# Altium schematic sheet TSAL_REV2_2.SchDoc
size A
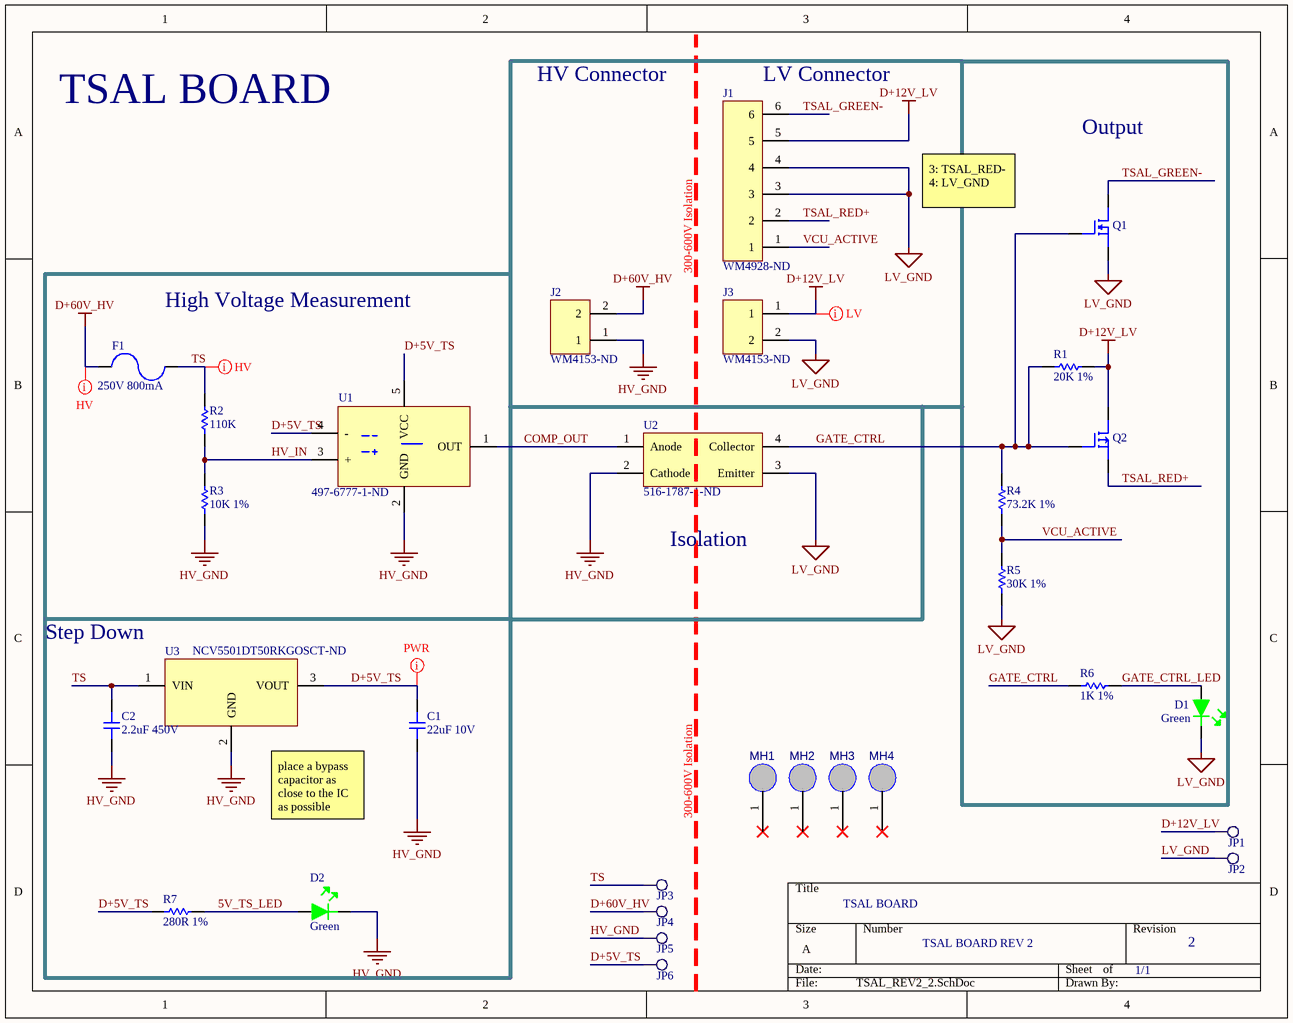
[diagram p0: TSAL_REV2_2.SchDoc]

## Parts
C1  22uF 10V  [CAP-0805]
C2  2.2uF 450V  [CAP-2220]
D1  Green  [LED-0603]
D2  Green  [LED-0603]
F1  250V 800mA  [Fuse-10x3]
J1  WM4928-ND  [6PIN]
J2  WM4153-ND  [2PIN]
J3  WM4153-ND  [2PIN]
JP1  Testpoint2  [TP2]  (value not drawn)
JP2  Testpoint2  [TP2]  (value not drawn)
JP3  Testpoint2  [TP2]  (value not drawn)
JP4  Testpoint2  [TP2]  (value not drawn)
JP5  Testpoint2  [TP2]  (value not drawn)
JP6  Testpoint2  [TP2]  (value not drawn)
MH1  MountingHole  [MH4.2MM]  (value not drawn)
MH2  MountingHole  [MH4.2MM]  (value not drawn)
MH3  MountingHole  [MH4.2MM]  (value not drawn)
MH4  MountingHole  [MH4.2MM]  (value not drawn)
Q1  IPD50N06S4L12ATMA2CT-ND  [DPAK-TO252]  (value not drawn)
Q2  NTD2955T4GOSCT-ND  [DPAK-TO252]  (value not drawn)
R1  20K 1%  [RES-0603]
R2  110K  [RES-0805]
R3  10K 1%  [RES-0805]
R4  73.2K 1%  [RES-0603]
R5  30K 1%  [RES-0603]
R6  1K 1%  [RES-0603]
R7  280R 1%  [RES-0603]
U1  497-6777-1-ND  [SOT-23-5]
U2  516-1787-1-ND  [4-SSOP]
U3  NCV5501DT50RKGOSCT-ND  [DPAK-TO252]

## Blocks framed on the sheet
Output: D1 Q1 Q2 R1 R4-R6

## Nets
D+12V_LV: J1.5 J3.1 JP1.1 Q2.2 R1.2
D+60V_HV: F1.1 J2.2 JP4.1
HV_GND: C1.1 C2.2 D2.2 J2.1 JP5.1 R3.1 U1.2(GND) U2.2(Cathode) U3.2(GND)
LV_GND: D1.2 J1.3 J1.4 J3.2 JP2.1 Q1.3 R5.1 U2.3(Emitter)
5V_TS_LED: D2.1 R7.2
COMP_OUT: U1.1(OUT) U2.1(Anode)
D+5V_TS: C1.2 JP6.1 R7.1 U1.4(-) U1.5(VCC) U3.3(VOUT)
GATE_CTRL: Q1.1 Q2.1 R1.1 R4.2 R6.1 U2.4(Collector)
GATE_CTRL_LED: D1.1 R6.2
HV_IN: R2.1 R3.2 U1.3(+)
TS: C2.1 F1.2 JP3.1 R2.2 U3.1(VIN)
TSAL_GREEN-: J1.6 Q1.2
TSAL_RED+: J1.2 Q2.3
VCU_ACTIVE: J1.1 R4.1 R5.2

Not connected (* = marked no-connect by the designer): MH1 1*; MH2 1*; MH3 1*; MH4 1*

## Layout directives
net class HV: D+60V_HV, TS
net class LV: D+12V_LV
net class PWR: D+5V_TS

## Notes on the sheet
- HV Connector
- (near J1) LV Connector
- TSAL BOARD
- 3: TSAL_RED-
  4: LV_GND
- 300-600V Isolation
- (near F1) High Voltage Measurement
- Isolation
- Step Down
- (near U3) place a bypass capacitor as close to the IC as possible
- TSAL BOARD REV 2
- 1/1
- 2

## Library data of the parts
C1 = 0805-22uF-10V: CAP CER 22UF 10V X5R 0805; Manufacturer: KEMET; Manufacturer Part Number: C0805C226M8PACTU; Dielectric Material: Ceramic; Dissipation Factor: 10%; Tolerance: 20%; Supplier 1: Digi-Key; Stock 1: 29030; Pricing 1: 1=0.47, 10=0.331, 100=0.2179, 500=0.16142, 1000=0.1372 (USD); Mount: Surface Mount; Case/Package: 0805; Case Code (Metric): 2012; Case Code (Imperial): 0805; Min Operating Temperature: -55°C; Max Operating Temperature: 85°C; Packaging: Tape and Reel; Capacitance: 22uF; Voltage Rating: 10V; Voltage: 10V; Dielectric: X5R; Termination: Solder; Voltage Rating (DC): 10V; Length: 0.079inch; Height: 1.25mm; Width: 0.049inch; Thickness: 0.055inch; Depth: 1.25mm; Lead Free: Lead Free; ComponentLink1URL: http://www.farnell.com/datasheets/2746360.pdf?src-supplier=Newark; ComponentLink1Description: http://www.farnell.com/datasheets/2746360.pdf?src-supplier=Newark; ComponentLink2URL: http://www.farnell.com/datasheets/2746360.pdf?src-supplier=Farnell; ComponentLink2Description: http://www.farnell.com/datasheets/2746360.pdf?src-supplier=Farnell; ComponentLink3URL: http://www.farnell.com/datasheets/2746360.pdf?src-supplier=Element14; ComponentLink3Description: http://www.farnell.com/datasheets/2746360.pdf?src-supplier=Element14; ComponentLink4URL: https://api.kemet.com/component-edge/download/datasheet/C0805C226M8PAC7800.pdf?src-supplier=Digi-Key; ComponentLink4Description: https://api.kemet.com/component-edge/download/datasheet/C0805C226M8PAC7800.pdf?src-supplier=Digi-Key; ComponentLink5URL: http://www.alliedelec.com/m/d/f3c02ddb98afa3dd1adcb801109671e9.pdf?src-supplier=Allied+Electronics; ComponentLink5Description: http://www.alliedelec.com/m/d/f3c02ddb98afa3dd1adcb801109671e9.pdf?src-supplier=Allied+Electronics; Supplier Part Number 1: 399-12069-6-ND
C2 = 2220-2.2uF-450V: CAP CER 2.2UF 450V X6S 2220; Manufacturer: TDK; Manufacturer Part Number: C5750X6S2W225K250KA; Tolerance: 10%; Supplier 1: Digi-Key; Stock 1: 8149; Pricing 1: 1=3.66, 10=2.957, 100=2.258 (USD); Mount: Surface Mount; Case/Package: 2220; Weight: 0.016932oz; Case Code (Metric): 5750; Case Code (Imperial): 2220; Min Operating Temperature: -55°C; Max Operating Temperature: 105°C; Package Quantity: 1; Capacitance: 2.2uF; Voltage Rating: 450V; Packaging: Tape and Reel; Dielectric: X6S; Termination: SMD/SMT; Voltage Rating (DC): 450V; Length: 5.7mm; Height: 2.5mm; Width: 0.197inch; Thickness: 0.11inch; Depth: 5mm; Radiation Hardening: No; REACH SVHC: No SVHC; Lead Free: Lead Free; ComponentLink1URL: http://product.tdk.com/capacitor/mlcc/en/documents/mlcc_commercial_midvoltage_en.pdf?src-supplier=Avnet+Europe; ComponentLink1Description: http://product.tdk.com/capacitor/mlcc/en/documents/mlcc_commercial_midvoltage_en.pdf?src-supplier=Avnet+Europe; Supplier Part Number 1: 445-7781-6-ND
D1 D2 = LED-Green: LED GREEN CLEAR 0603 SMD; Manufacturer: Wurth Electronics; Manufacturer Part Number: 150060VS75000; Luminous Intensity: 40mcd; Viewing Angle: 140°; Forward Voltage: 2V; Wavelength: 570nm; Lens Style: Clear,Rectangular; Forward Current: 30mA; Test Current: 20mA; Supplier 1: Digi-Key; Stock 1: 118118; Pricing 1: 1=0.14, 50=0.133, 100=0.114, 500=0.099 (USD); Mount: Surface Mount; Case/Package: 0603; Number of Pins: 2; Color: Green; Case Code (Metric): 1608; Case Code (Imperial): 0603; Min Operating Temperature: -40°C; Max Operating Temperature: 85°C; Package Quantity: 1; Packaging: Tape and Reel; Dominant Wavelength: 570nm; Length: 1.6mm; Height: 0.7mm; Width: 0.8mm; REACH SVHC: Unknown; ComponentLink1URL: https://katalog.we-online.de/led/datasheet/150060VS75000.pdf?src-supplier=Digi-Key; ComponentLink1Description: https://katalog.we-online.de/led/datasheet/150060VS75000.pdf?src-supplier=Digi-Key; Supplier Part Number 1: 732-4980-1-ND
F1 = Fuse 250V-0.8A: FUSE SMT 3912 FAST 250V 800MA; Manufacturer: Bel; Manufacturer Part Number: 0678D0800-02; Fuse Type: Board Mount (Cartridge Style Excluded); Voltage Rating (AC): 350V; DC Cold Resistance: 380mR; Approvals: cURus; Supplier 1: Digi-Key; Stock 1: 1992; Pricing 1: 1=0.91, 5=0.884, 10=0.827, 50=0.684, 100=0.57, 250=0.55576, 500=0.47026, 1000=0.41325 (USD); Mount: Surface Mount; Case/Package: SMD/SMT; Min Operating Temperature: -55°C; Max Operating Temperature: 125°C; Packaging: Tape and Reel; Current Rating: 800mA; Voltage Rating (DC): 250V; ComponentLink1URL: https://media.digikey.com/pdf/Data%20Sheets/Bel%20Fuse%20PDFs/0678D_Series.pdf?src-supplier=Digi-Key; ComponentLink1Description: https://media.digikey.com/pdf/Data%20Sheets/Bel%20Fuse%20PDFs/0678D_Series.pdf?src-supplier=Digi-Key
J1 = 6PIN: CONN HEADER R/A 6POS 2.54MM; Manufacturer: Molex; Manufacturer Part Number: 70553-0040; Contact Resistance: 30mR; Number of Positions: 6; Current Rating: 3A; Voltage Rating: 250V; Gender: Male; Insulation Resistance: 1GR; Glow Wire Compliant: Non-compliant; Supplier 1: Digi-Key; Stock 1: 2212; Pricing 1: 1=1.58, 10=1.434, 100=1.2289, 500=1.0241, 1000=0.8778, 5000=0.77832, 10000=0.76076 (USD); Mount: Through Hole; Contact Material: Bronze,Copper Alloy,Brass; Contact Plating: Tin; Housing Color: Black; Color: Black; Housing Material: Thermoplastic; Material: Brass; Min Operating Temperature: -40°C; Max Operating Temperature: 105°C; Number of Rows: 1; Packaging: Rail/Tube; Termination: Solder; Number of Contacts: 6; Orientation: Right Angle; Package Quantity: 1200; Max Current Rating: 3A; Max Voltage Rating (AC): 250V; Voltage Rating (DC): 250V; Number of Circuits: 6; Length: 17.79mm; Height: 6.99mm; Pitch: 2.54mm; Depth: 13.59mm; Radiation Hardening: No; REACH SVHC: Unknown; ELV: Compliant; Lead Free: Lead Free; Flammability Rating: UL94 V-0; ComponentLink1URL: http://uk.rs-online.com/webdocs/13c4/0900766b813c4993.pdf?src-supplier=RSComponents; ComponentLink1Description: http://uk.rs-online.com/webdocs/13c4/0900766b813c4993.pdf?src-supplier=RSComponents; ComponentLink2URL: http://www.molex.com/webdocs/datasheets/pdf/en-us/0705530040_PCB_HEADERS.pdf?src-supplier=Avnet+Europe; ComponentLink2Description: http://www.molex.com/webdocs/datasheets/pdf/en-us/0705530040_PCB_HEADERS.pdf?src-supplier=Avnet+Europe; ComponentLink3URL: http://www.farnell.com/datasheets/1844551.pdf?src-supplier=Farnell; ComponentLink3Description: http://www.farnell.com/datasheets/1844551.pdf?src-supplier=Farnell; ComponentLink4URL: http://www.mouser.com/ds/2/276/0705530040_PCB_HEADERS-172948.pdf?src-supplier=Mouser; ComponentLink4Description: http://www.mouser.com/ds/2/276/0705530040_PCB_HEADERS-172948.pdf?src-supplier=Mouser; ComponentLink5URL: http://www.farnell.com/cad/655744.pdf?src-supplier=Element14; ComponentLink5Description: http://www.farnell.com/cad/655744.pdf?src-supplier=Element14; ComponentLink6URL: http://www.jameco.com/Jameco/Products/ProdDS/1302975.pdf?src-supplier=Jameco; ComponentLink6Description: http://www.jameco.com/Jameco/Products/ProdDS/1302975.pdf?src-supplier=Jameco; Supplier Part Number 1: WM4928-ND
J2 J3 = 2PIN: CONN HEADER R/A 2POS 2.54MM; Manufacturer: Molex; Manufacturer Part Number: 0705530106; Number of Positions: 2; Contact Resistance: 30mR; Connector Type: Male Pin; Supplier 1: Digi-Key; Stock 1: 2224; Pricing 1: 1=1.38, 10=1.25, 100=1.071, 500=0.8925, 1000=0.765, 5000=0.6783, 10000=0.663 (USD); Mount: Through Hole; Housing Material: Polyester; Contact Plating: Gold; Contact Material: Bronze; Color: Black; Housing Color: Black; Min Operating Temperature: -40°C; Max Operating Temperature: 105°C; Number of Rows: 1; Packaging: Rail/Tube; Termination: Solder; Number of Contacts: 2; Orientation: Right Angle; Length: 7.37mm; Pitch: 2.54mm; Depth: 13.59mm; Contact Mating Length: 0.24inch; ComponentLink1URL: http://www.molex.com/webdocs/datasheets/pdf/en-us/0705530106_PCB_HEADERS.pdf?src-supplier=Avnet+Asia; ComponentLink1Description: http://www.molex.com/webdocs/datasheets/pdf/en-us/0705530106_PCB_HEADERS.pdf?src-supplier=Avnet+Asia; ComponentLink2URL: https://www.molex.com/pdm_docs/ps/PS-70400.pdf?src-supplier=Digi-Key; ComponentLink2Description: https://www.molex.com/pdm_docs/ps/PS-70400.pdf?src-supplier=Digi-Key; Supplier Part Number 1: WM4153-ND
JP1-JP6 = Testpoint2: Single layer pad TP
MH1-MH4 = MH4.2mm: Mounting hole, 4.2mm; Case: TH
Q1 = N-FET-60V-50A: MOSFET N-CH 60V 50A TO252-3; Manufacturer: Infineon; Rise Time: 2ns; Rds On Max: 12mR; Input Capacitance: 2.89nF; Max Power Dissipation: 50W; Turn-On Delay Time: 6ns; Turn-Off Delay Time: 25ns; Fall Time: 5ns; Gate to Source Voltage (Vgs): 16V; Manufacturer Part Number: IPD50N06S4L12ATMA2; Stock 1: 3187; Pricing 1: 1=0.92, 10=0.806, 25=0.7572, 100=0.5497, 250=0.53012, 500=0.45928, 1000=0.39088 (USD); Mount: Surface Mount; Case/Package: TO-252-3; Number of Pins: 3; Min Operating Temperature: -55°C; Max Operating Temperature: 175°C; Packaging: Tape and Reel; Drain to Source Voltage (Vdss): 60V; Continuous Drain Current (ID): 50A; Max Dual Supply Voltage: 60V; Supplier Part Number 1: IPD50N06S4L12ATMA2DKR-ND; Supplier 1: Digi-Key
Q2 = P-FET-60V-12A: MOSFET P-CH 60V 12A DPAK; Manufacturer: ON Semiconductor; Rise Time: 45ns; Nominal Vgs: -2.8V; Input Capacitance: 750pF; Max Power Dissipation: 55W; Number of Elements: 1; Rds On Max: 180mR; Fall Time: 48ns; Drain to Source Resistance: 155mR; Turn-Off Delay Time: 26ns; Drain to Source Voltage (Vdss): -60V; Turn-On Delay Time: 10ns; Element Configuration: Single; Gate to Source Voltage (Vgs): 20V; Current Rating: -12A; Supplier 1: Digi-Key; Manufacturer Part Number: NTD2955T4G; Stock 1: 9993; Pricing 1: 1=0.76, 10=0.672, 25=0.6316, 100=0.4583, 250=0.44204, 500=0.38296, 1000=0.32592 (USD); Case/Package: DPAK; Number of Pins: 3; Contact Plating: Tin,Matte; Min Operating Temperature: -55°C; Max Operating Temperature: 175°C; Package Quantity: 1; Packaging: Tape and Reel; Power Dissipation: 55W; Continuous Drain Current (ID): 12A; Threshold Voltage: -2.8V; Drain to Source Breakdown Voltage: -60V; Voltage Rating (DC): -60V; On-State Resistance: 180mR; Number of Channels: 1; Length: 6.73mm; Height: 2.38mm; Width: 6.22mm; Radiation Hardening: No; REACH SVHC: No SVHC; Lead Free: Lead Free; ComponentLink1URL: http://www.onsemi.com/pub/Collateral/NTD2955-D.PDF?src-supplier=Avnet; ComponentLink1Description: http://www.onsemi.com/pub/Collateral/NTD2955-D.PDF?src-supplier=Avnet; ComponentLink2URL: http://www.onsemi.com/pub/Collateral/NTD2955-D.PDF?src-supplier=Avnet+Europe; ComponentLink2Description: http://www.onsemi.com/pub/Collateral/NTD2955-D.PDF?src-supplier=Avnet+Europe; ComponentLink3URL: http://www.onsemi.com/pub_link/Collateral/NTD2955-D.PDF?src-supplier=Element14; ComponentLink3Description: http://www.onsemi.com/pub_link/Collateral/NTD2955-D.PDF?src-supplier=Element14; ComponentLink4URL: http://www.onsemi.com/pub/Collateral/NTD2955-D.PDF?src-supplier=Digi-Key; ComponentLink4Description: http://www.onsemi.com/pub/Collateral/NTD2955-D.PDF?src-supplier=Digi-Key; ComponentLink5URL: http://www.jameco.com/Jameco/Products/ProdDS/1178118.pdf?src-supplier=Jameco; ComponentLink5Description: http://www.jameco.com/Jameco/Products/ProdDS/1178118.pdf?src-supplier=Jameco; Supplier Part Number 1: NTD2955T4GOSDKR-ND
R1 = 0603-20KR: RES SMD 20K OHM 1% 1/10W 0603; Manufacturer: Yageo; Manufacturer Part Number: RC0603FR-0720KL; Resistance: 20kR; Temperature Coefficient: 100ppm/°C; Voltage Rating (DC): 50V; Power Rating: 100mW; Supplier 1: Digi-Key; Stock 1: 3611201; Pricing 1: 1=0.1, 10=0.023, 100=0.0094, 1000=0.00421, 2500=0.00366 (USD); Case/Package: 0603; Number of Pins: 2; Case Code (Imperial): 0603; Case Code (Metric): 1608; Min Operating Temperature: -55°C; Max Operating Temperature: 155°C; Packaging: Tape and Reel; Tolerance: 1%; Composition: Thick Film; Voltage Rating: 50V; Package Quantity: 1; Termination: SMD/SMT; Number of Terminations: 2; Military Standard: Not; Max Power Dissipation: 100mW; Features: Moisture Resistant; Length: 0.063inch; Height: 0.022inch; Width: 0.031inch; Depth: 0.8mm; Lead Free: Lead Free; REACH SVHC: No SVHC; ComponentLink1URL: http://documents.rs-components.com/techlib://itc_doclist_GB.htm?stockno=5050145&src-supplier=RSComponents; ComponentLink1Description: http://documents.rs-components.com/techlib://itc_doclist_GB.htm?stockno=5050145&src-supplier=RSComponents; ComponentLink2URL: http://www.farnell.com/datasheets/2167052.pdf?src-supplier=Element14; ComponentLink2Description: http://www.farnell.com/datasheets/2167052.pdf?src-supplier=Element14; ComponentLink3URL: http://www.yageo.com/documents/recent/PYu-RC_Group_51_RoHS_L_10.pdf?src-supplier=Digi-Key; ComponentLink3Description: http://www.yageo.com/documents/recent/PYu-RC_Group_51_RoHS_L_10.pdf?src-supplier=Digi-Key; Supplier Part Number 1: 311-20.0KHRDKR-ND
R2 = 0805-110KR: RES SMD 110K OHM 1% 1/8W 0805; Manufacturer: Yageo; Manufacturer Part Number: RC0805FR-07110KL; Power Rating: 125mW; Resistance: 110kR; Voltage Rating: 150V; Temperature Coefficient: 100ppm/°C; ComponentLink1URL: http://www.yageo.ru/pdf/RC0805.pdf?src-supplier=Future+Electronics; ComponentLink1Description: http://www.yageo.ru/pdf/RC0805.pdf?src-supplier=Future+Electronics; ComponentLink2URL: http://www.mouser.com/ds/2/447/Yageo_08112016_RC0805-968729.pdf?src-supplier=Mouser; ComponentLink2Description: http://www.mouser.com/ds/2/447/Yageo_08112016_RC0805-968729.pdf?src-supplier=Mouser; ComponentLink3URL: http://www.yageo.com/documents/recent/PYu-RC_Group_51_RoHS_L_9.pdf?src-supplier=Digi-Key; ComponentLink3Description: http://www.yageo.com/documents/recent/PYu-RC_Group_51_RoHS_L_9.pdf?src-supplier=Digi-Key; ComponentLink4URL: http://www.yageo.com/documents/recent/PYu-RC_Group_51_RoHS_L_10.pdf?src-supplier=Digi-Key; ComponentLink4Description: http://www.yageo.com/documents/recent/PYu-RC_Group_51_RoHS_L_10.pdf?src-supplier=Digi-Key; ComponentLink5URL: http://documents.rs-components.com/techlib://itc_doclist_GB.htm?stockno=6185191&src-supplier=RSComponents; ComponentLink5Description: http://documents.rs-components.com/techlib://itc_doclist_GB.htm?stockno=6185191&src-supplier=RSComponents; Supplier 1: Digi-Key; Stock 1: 344300; Pricing 1: 1=0.1, 10=0.04, 100=0.0163, 1000=0.00731, 2500=0.00635 (USD); Mount: Surface Mount; Case/Package: 0805; Case Code (Imperial): 0805; Case Code (Metric): 2012; Min Operating Temperature: -55°C; Max Operating Temperature: 155°C; Tolerance: 1%; Packaging: Tape and Reel; Package Quantity: 5000; Termination: SMD/SMT; Composition: Thick Film; Military Standard: Not; Voltage Rating (DC): 150V; Number of Terminations: 2; Max Power Dissipation: 125mW; Features: Moisture Resistant; Working Voltage: 150V; Length: 2mm; Height: 0.024inch; Width: 0.049inch; Depth: 1.25mm; Lead Free: Lead Free; Supplier Part Number 1: 311-110KCRDKR-ND
R3 = 0805-10KR: RES SMD 10K OHM 1% 1/8W 0805; Manufacturer: Yageo; Manufacturer Part Number: RC0805FR-0710KL; Resistance: 10kR; Temperature Coefficient: 100ppm/°C; Power Rating: 125mW; Voltage Rating: 150V; Supplier 1: Digi-Key; Stock 1: 26112993; Pricing 1: 1=0.1, 10=0.04, 100=0.0163, 1000=0.00731, 2500=0.00635 (USD); Case/Package: 0805; Case Code (Imperial): 0805; Case Code (Metric): 2012; Min Operating Temperature: -55°C; Max Operating Temperature: 155°C; Packaging: Tape and Reel; Tolerance: 1%; Composition: Thick Film; Package Quantity: 1; Termination: SMD/SMT; Number of Terminations: 2; Military Standard: Not; Max Power Dissipation: 125mW; Features: Moisture Resistant; Length: 2mm; Height: 0.024inch; Width: 0.049inch; Depth: 1.25mm; REACH SVHC: Unknown; Lead Free: Lead Free; ComponentLink1URL: http://www.yageo.com/documents/recent/PYu-RC_Group_51_RoHS_L_9.pdf?src-supplier=Mouser; ComponentLink1Description: http://www.yageo.com/documents/recent/PYu-RC_Group_51_RoHS_L_9.pdf?src-supplier=Mouser; ComponentLink2URL: http://www.farnell.com/datasheets/2167052.pdf?src-supplier=Element14; ComponentLink2Description: http://www.farnell.com/datasheets/2167052.pdf?src-supplier=Element14; ComponentLink3URL: http://www.yageo.com/documents/recent/PYu-RC_Group_51_RoHS_L_10.pdf?src-supplier=Digi-Key; ComponentLink3Description: http://www.yageo.com/documents/recent/PYu-RC_Group_51_RoHS_L_10.pdf?src-supplier=Digi-Key; ComponentLink4URL: http://www.yageo.ru/pdf/RC0805.pdf?src-supplier=Future+Electronics; ComponentLink4Description: http://www.yageo.ru/pdf/RC0805.pdf?src-supplier=Future+Electronics; Supplier Part Number 1: 311-10.0KCRCT-ND
R4 = 0603-73.2KR: RES SMD 73.2K OHM 1% 1/10W 0603; Manufacturer: Yageo; Manufacturer Part Number: RC0603FR-0773K2L; Power Rating: 100mW; Resistance: 73.2kR; Voltage Rating: 50V; Temperature Coefficient: 100ppm/°C; Supplier 1: Digi-Key; Stock 1: 696637; Pricing 1: 1=0.1, 10=0.023, 100=0.0094, 1000=0.00421, 2500=0.00366 (USD); Case/Package: 0603; Case Code (Imperial): 0603; Case Code (Metric): 1608; Contact Plating: Tin,Matte; Min Operating Temperature: -55°C; Max Operating Temperature: 155°C; Tolerance: 1%; Packaging: Tape and Reel; Termination: SMD/SMT; Composition: Thick Film; Military Standard: Not; Voltage Rating (DC): 50V; Length: 1.6mm; Height: 0.45mm; Width: 0.8mm; Depth: 0.8mm; Lead Free: Lead Free; ComponentLink1URL: http://www.yageo.com/documents/recent/PYu-RC0603_51_RoHS_L_4.pdf?src-supplier=Avnet; ComponentLink1Description: http://www.yageo.com/documents/recent/PYu-RC0603_51_RoHS_L_4.pdf?src-supplier=Avnet; ComponentLink2URL: http://www.yageo.com/documents/recent/PYu-RC0603_51_RoHS_L_4.pdf?src-supplier=Avnet+Europe; ComponentLink2Description: http://www.yageo.com/documents/recent/PYu-RC0603_51_RoHS_L_4.pdf?src-supplier=Avnet+Europe; Supplier Part Number 1: 311-73.2KHRDKR-ND
R5 = 0603-30KR: RES SMD 30K OHM 1% 1/10W 0603; Manufacturer: Yageo; Manufacturer Part Number: RC0603FR-0730KL; Resistance: 30kR; Power Rating: 100mW; Temperature Coefficient: 100ppm/°C; Voltage Rating (DC): 50V; Supplier 1: Digi-Key; Stock 1: 1047616; Pricing 1: 1=0.1, 10=0.023, 100=0.0094, 1000=0.00421, 2500=0.00366 (USD); Case/Package: 0603; Number of Pins: 2; Case Code (Imperial): 0603; Case Code (Metric): 1608; Min Operating Temperature: -55°C; Max Operating Temperature: 155°C; Tolerance: 1%; Packaging: Tape and Reel; Voltage Rating: 50V; Termination: SMD/SMT; Military Standard: Not; Composition: Thick Film; Package Quantity: 5000; Length: 1.6mm; Height: 0.45mm; Width: 0.8mm; Depth: 0.8mm; Lead Free: Lead Free; REACH SVHC: Unknown; ComponentLink1URL: http://www.mouser.com/catalog/specsheets/RC0603.pdf?src-supplier=Mouser; ComponentLink1Description: http://www.mouser.com/catalog/specsheets/RC0603.pdf?src-supplier=Mouser; ComponentLink2URL: http://www.farnell.com/datasheets/2167052.pdf?src-supplier=Element14; ComponentLink2Description: http://www.farnell.com/datasheets/2167052.pdf?src-supplier=Element14; Supplier Part Number 1: 311-30.0KHRDKR-ND
R6 = 0603-1KR: RES SMD 1K OHM 1% 1/10W 0603; Manufacturer: Vishay Dale; Manufacturer Part Number: CRCW06031K00FKEA; Resistance: 1kR; Power Rating: 100mW; Voltage Rating: 75V; Temperature Coefficient: 100ppm/°C; Supplier 1: Digi-Key; Stock 1: 671453; Pricing 1: 1=0.1, 10=0.034, 100=0.0139, 1000=0.00623, 2500=0.0054 (USD); Mount: Surface Mount; Case/Package: 0603; Number of Pins: 2; Weight: 7.1E-05oz; Case Code (Metric): 1608; Case Code (Imperial): 0603; Contact Plating: Tin; Min Operating Temperature: -55°C; Max Operating Temperature: 155°C; Composition: Thick Film; Tolerance: 1%; Packaging: Tape and Reel; Package Quantity: 10; Number of Terminations: 2; Termination: SMD/SMT; Military Standard: Not; Max Power Dissipation: 100mW; Voltage Rating (DC): 75V; Features: Automotive AEC-Q200; Length: 1.55mm; Height: 0.45mm; Width: 0.033inch; Depth: 0.85mm; Radiation Hardening: No; REACH SVHC: Unknown; Lead Free: Lead Free; ComponentLink1URL: http://www.vishay.com/docs/20035/dcrcwe3.pdf?src-supplier=Digi-Key; ComponentLink1Description: http://www.vishay.com/docs/20035/dcrcwe3.pdf?src-supplier=Digi-Key; ComponentLink2URL: http://uk.rs-online.com/webdocs/0d98/0900766b80d98afc.pdf?src-supplier=RSComponents; ComponentLink2Description: http://uk.rs-online.com/webdocs/0d98/0900766b80d98afc.pdf?src-supplier=RSComponents; ComponentLink3URL: http://www.vishay.com/docs/20035/dcrcwe3.pdf?src-supplier=Avnet; ComponentLink3Description: http://www.vishay.com/docs/20035/dcrcwe3.pdf?src-supplier=Avnet; ComponentLink4URL: http://www.vishay.com/docs/20035/dcrcwe3.pdf?src-supplier=Avnet+Asia; ComponentLink4Description: http://www.vishay.com/docs/20035/dcrcwe3.pdf?src-supplier=Avnet+Asia; ComponentLink5URL: http://www.farnell.com/datasheets/2310790.pdf?src-supplier=Element14; ComponentLink5Description: http://www.farnell.com/datasheets/2310790.pdf?src-supplier=Element14; ComponentLink6URL: https://www.distrelec.biz/Web/Downloads/a_/en/flD-CRCW-e3_data_en.pdf?mime=application%2Fpdf&src-supplier=Distrelec; ComponentLink6Description: https://www.distrelec.biz/Web/Downloads/a_/en/flD-CRCW-e3_data_en.pdf?mime=application%2Fpdf&src-supplier=Distrelec; ComponentLink7URL: http://www.vishay.com/docs/20035/dcrcwe3.pdf?src-supplier=Future+Electronics; ComponentLink7Description: http://www.vishay.com/docs/20035/dcrcwe3.pdf?src-supplier=Future+Electronics; ComponentLink8URL: http://www.vishay.com/docs/20035/dcrcwe3.pdf?src-supplier=Avnet+Europe; ComponentLink8Description: http://www.vishay.com/docs/20035/dcrcwe3.pdf?src-supplier=Avnet+Europe; Supplier Part Number 1: 541-1.00KHCT-ND
R7 = 0603-280R: RES SMD 280 OHM 1% 1/10W 0603; Manufacturer: Yageo; Manufacturer Part Number: RC0603FR-07280RL; Power Rating: 100mW; Voltage Rating: 50V; Temperature Coefficient: 100ppm/°C; Supplier 1: Digi-Key; Stock 1: 125324; Pricing 1: 1=0.1, 10=0.023, 100=0.0094, 1000=0.00421, 2500=0.00366 (USD); Case/Package: 0603; Case Code (Metric): 1608; Case Code (Imperial): 0603; Min Operating Temperature: -55°C; Max Operating Temperature: 155°C; Package Quantity: 1; Resistance: 280R; Tolerance: 1%; Packaging: Tape and Reel; Composition: Thick Film; Number of Terminations: 2; Termination: SMD/SMT; Military Standard: Not; Max Power Dissipation: 100mW; Voltage Rating (DC): 50V; Features: Moisture Resistant; Length: 1.6mm; Height: 0.022inch; Width: 0.031inch; Depth: 0.8mm; Lead Free: Lead Free; ComponentLink1URL: http://www.yageo.com/documents/recent/PYu-RC_Group_51_RoHS_L_9.pdf?src-supplier=Digi-Key; ComponentLink1Description: http://www.yageo.com/documents/recent/PYu-RC_Group_51_RoHS_L_9.pdf?src-supplier=Digi-Key; ComponentLink2URL: http://www.mouser.com/catalog/specsheets/RC0603.pdf?src-supplier=Mouser; ComponentLink2Description: http://www.mouser.com/catalog/specsheets/RC0603.pdf?src-supplier=Mouser; Supplier Part Number 1: 311-280HRDKR-ND
U1 = Compare-TS861ILT: IC COMPARATOR R-R MCRPWR SOT23-5; Manufacturer: STMicroelectronics; Voltage Gain: 240dB; Min Supply Voltage: 2.7V; Max Supply Voltage: 10V; Number of Channels: 1; Max Power Dissipation: 500mW; Nominal Supply Current: 14uA; Common Mode Rejection Ratio: 70dB; Input Offset Voltage (Vos): 15mV; Input Bias Current: 300pA; Quiescent Current: 16uA; Propagation Delay: 2us; Max Supply Current: 12uA; Output Current per Channel: 5mA; Response Time: 500ns; Power Supply Rejection Ratio (PSRR): 80dB; Supplier 1: Digi-Key; Manufacturer Part Number: TS861ILT; Stock 1: 14868; Pricing 1: 1=0.78, 10=0.682, 25=0.6412, 100=0.486, 250=0.4136, 500=0.39292, 1000=0.29986 (USD); Mount: Surface Mount; Case/Package: SOT-23; Number of Pins: 5; Min Operating Temperature: -40°C; Max Operating Temperature: 85°C; Package Quantity: 3000; Number of Elements: 1; Packaging: Tape and Reel; Max Input Current: 300pA; Power Dissipation: 500mW; Output Current: 5mA; Type: General Purpose; Radiation Hardening: No; REACH SVHC: No SVHC; Lead Free: Lead Free; ComponentLink1URL: http://www.farnell.com/datasheets/1690531.pdf?src-supplier=Element14; ComponentLink1Description: http://www.farnell.com/datasheets/1690531.pdf?src-supplier=Element14; ComponentLink2URL: http://www.st.com/content/ccc/resource/technical/document/datasheet/dd/d1/7d/d5/d5/ce/49/c5/CD00001705.pdf/files/CD00001705.pdf/jcr:content/translations/en.CD00001705.pdf?src-supplier=Digi-Key; ComponentLink2Description: http://www.st.com/content/ccc/resource/technical/document/datasheet/dd/d1/7d/d5/d5/ce/49/c5/CD00001705.pdf/files/CD00001705.pdf/jcr:content/translations/en.CD00001705.pdf?src-supplier=Digi-Key; ComponentLink3URL: http://www.mouser.com/ds/2/389/ts861-957384.pdf?src-supplier=Mouser; ComponentLink3Description: http://www.mouser.com/ds/2/389/ts861-957384.pdf?src-supplier=Mouser; ComponentLink4URL: https://www.verical.com/server-webapp/html/getDatasheet?partID=160028&src-supplier=Verical; ComponentLink4Description: https://www.verical.com/server-webapp/html/getDatasheet?partID=160028&src-supplier=Verical; ComponentLink5URL: http://www.produktinfo.conrad.com/datenblaetter/1100000-1199999/001185659-da-01-en-IC_COMPARATOR_R_R_TS861ILT_SOT_23_5_STM.pdf?src-supplier=Conrad; ComponentLink5Description: http://www.produktinfo.conrad.com/datenblaetter/1100000-1199999/001185659-da-01-en-IC_COMPARATOR_R_R_TS861ILT_SOT_23_5_STM.pdf?src-supplier=Conrad; Supplier Part Number 1: 497-6777-6-ND
U2 = OPTO-ISO-3.75kV: OPTOISO 3.75KV TRANS 4MINIFLAT; Manufacturer: Broadcom Avago; Manufacturer Part Number: HCPL-181-00BE; Number of Channels: 1; Collector Emitter Voltage (VCEO): 80V; Forward Current: 50mA; Forward Voltage: 1.4V; Rise Time: 18000ns; Max Power Dissipation: 170mW; Reverse Breakdown Voltage: 6V; Collector Emitter Saturation Voltage: 200mV; Current Transfer Ratio: 260%; Input Current: 20mA; Approvals: UL,CSA,VDE; Supplier 1: Digi-Key; Stock 1: 94429; Pricing 1: 1=0.56, 10=0.433, 100=0.2778, 500=0.23886, 1000=0.18443 (USD); Mount: Surface Mount; Case/Package: SMD/SMT; Number of Pins: 4; Min Operating Temperature: -55°C; Max Operating Temperature: 100°C; Packaging: Tape and Reel; Max Output Voltage: 80V; Output Current per Channel: 50mA; Isolation Voltage: 3.75kV; Package Quantity: 1; Max Collector Current: 50mA; Max Input Current: 50mA; Fall Time: 18000ns; Number of Elements: 1; Power Dissipation: 170mW; Number of Circuits: 1; Radiation Hardening: No; REACH SVHC: No SVHC; Lead Free: Lead Free; ComponentLink1URL: http://www.farnell.com/datasheets/317140.pdf?src-supplier=Farnell; ComponentLink1Description: http://www.farnell.com/datasheets/317140.pdf?src-supplier=Farnell; ComponentLink2URL: http://uk.rs-online.com/webdocs/0db8/0900766b80db8748.pdf?src-supplier=RSComponents; ComponentLink2Description: http://uk.rs-online.com/webdocs/0db8/0900766b80db8748.pdf?src-supplier=RSComponents; ComponentLink3URL: http://www1.futureelectronics.com/doc/AVAGO%20TECHNOLOGIES/HCPL-181-00BE.pdf?src-supplier=Future+Electronics; ComponentLink3Description: http://www1.futureelectronics.com/doc/AVAGO%20TECHNOLOGIES/HCPL-181-00BE.pdf?src-supplier=Future+Electronics; ComponentLink4URL: https://www.verical.com/server-webapp/html/getDatasheet?partID=142397&src-supplier=Verical; ComponentLink4Description: https://www.verical.com/server-webapp/html/getDatasheet?partID=142397&src-supplier=Verical; ComponentLink5URL: http://www.farnell.com/datasheets/317140.pdf?src-supplier=Element14; ComponentLink5Description: http://www.farnell.com/datasheets/317140.pdf?src-supplier=Element14; ComponentLink6URL: https://www.distrelec.biz/Web/Downloads/_t/ds/HCPL-181_eng_tds.pdf?mime=application%2Fpdf&src-supplier=Distrelec; ComponentLink6Description: https://www.distrelec.biz/Web/Downloads/_t/ds/HCPL-181_eng_tds.pdf?mime=application%2Fpdf&src-supplier=Distrelec; Supplier Part Number 1: 516-1787-6-ND
U3 = LDO-5V-500mA: IC REG LINEAR 5V 500MA DPAK; Manufacturer: ON Semiconductor; Min Input Voltage: 2.5V; Number of Outputs: 1; Max Input Voltage: 16V; Dropout Voltage: 230mV; Polarity: Positive; Accuracy: 2.9%; Min Output Voltage: 1.25V; Output Type: Fixed; Supplier 1: Digi-Key; Manufacturer Part Number: NCV5501DT50RKG; Stock 1: 2168; Pricing 1: 1=0.81, 10=0.71, 25=0.6676, 100=0.506, 250=0.4306, 500=0.40908, 1000=0.31219 (USD); Mount: Surface Mount; Case/Package: DPAK; Number of Pins: 3; Contact Plating: Tin,Matte; Min Operating Temperature: -40°C; Max Operating Temperature: 125°C; Output Voltage: 5V; Output Current: 500mA; Packaging: Tape and Reel; Max Output Current: 500mA; Package Quantity: 2500; Number of Regulators: 1; Min Current Limit: 500mA; Output Voltage Accuracy: 2.9%; Length: 6.73mm; Height: 2.38mm; Width: 6.22mm; Radiation Hardening: No; Lead Free: Lead Free; ComponentLink1URL: https://www.verical.com/server-webapp/html/getDatasheet?partID=121510&src-supplier=Verical; ComponentLink1Description: https://www.verical.com/server-webapp/html/getDatasheet?partID=121510&src-supplier=Verical; ComponentLink2URL: http://www.onsemi.com/pub_link/Collateral/NCP5500-D.PDF?src-supplier=Future+Electronics; ComponentLink2Description: http://www.onsemi.com/pub_link/Collateral/NCP5500-D.PDF?src-supplier=Future+Electronics; ComponentLink3URL: http://www.onsemi.com/pub/Collateral/NCP5500-D.PDF?src-supplier=Avnet; ComponentLink3Description: http://www.onsemi.com/pub/Collateral/NCP5500-D.PDF?src-supplier=Avnet; ComponentLink4URL: http://www.onsemi.com/pub_link/Collateral/NCP5500-D.PDF?src-supplier=Digi-Key; ComponentLink4Description: http://www.onsemi.com/pub_link/Collateral/NCP5500-D.PDF?src-supplier=Digi-Key; Supplier Part Number 1: NCV5501DT50RKGOSDKR-ND